# Altium schematic sheet KS-WL-GW-POWER.SchDoc
size A4; CheckedBy: Fan mingjie; DrawnBy: Jason Huang; Address1: Buliding 5, No.1528; Address2: Gu Mei Rd HQ6; Address3: Shanghai, China; Address4: 20233; DocumentNumber: 1; Revision: 1; SheetNumber: 1; SheetTotal: 2
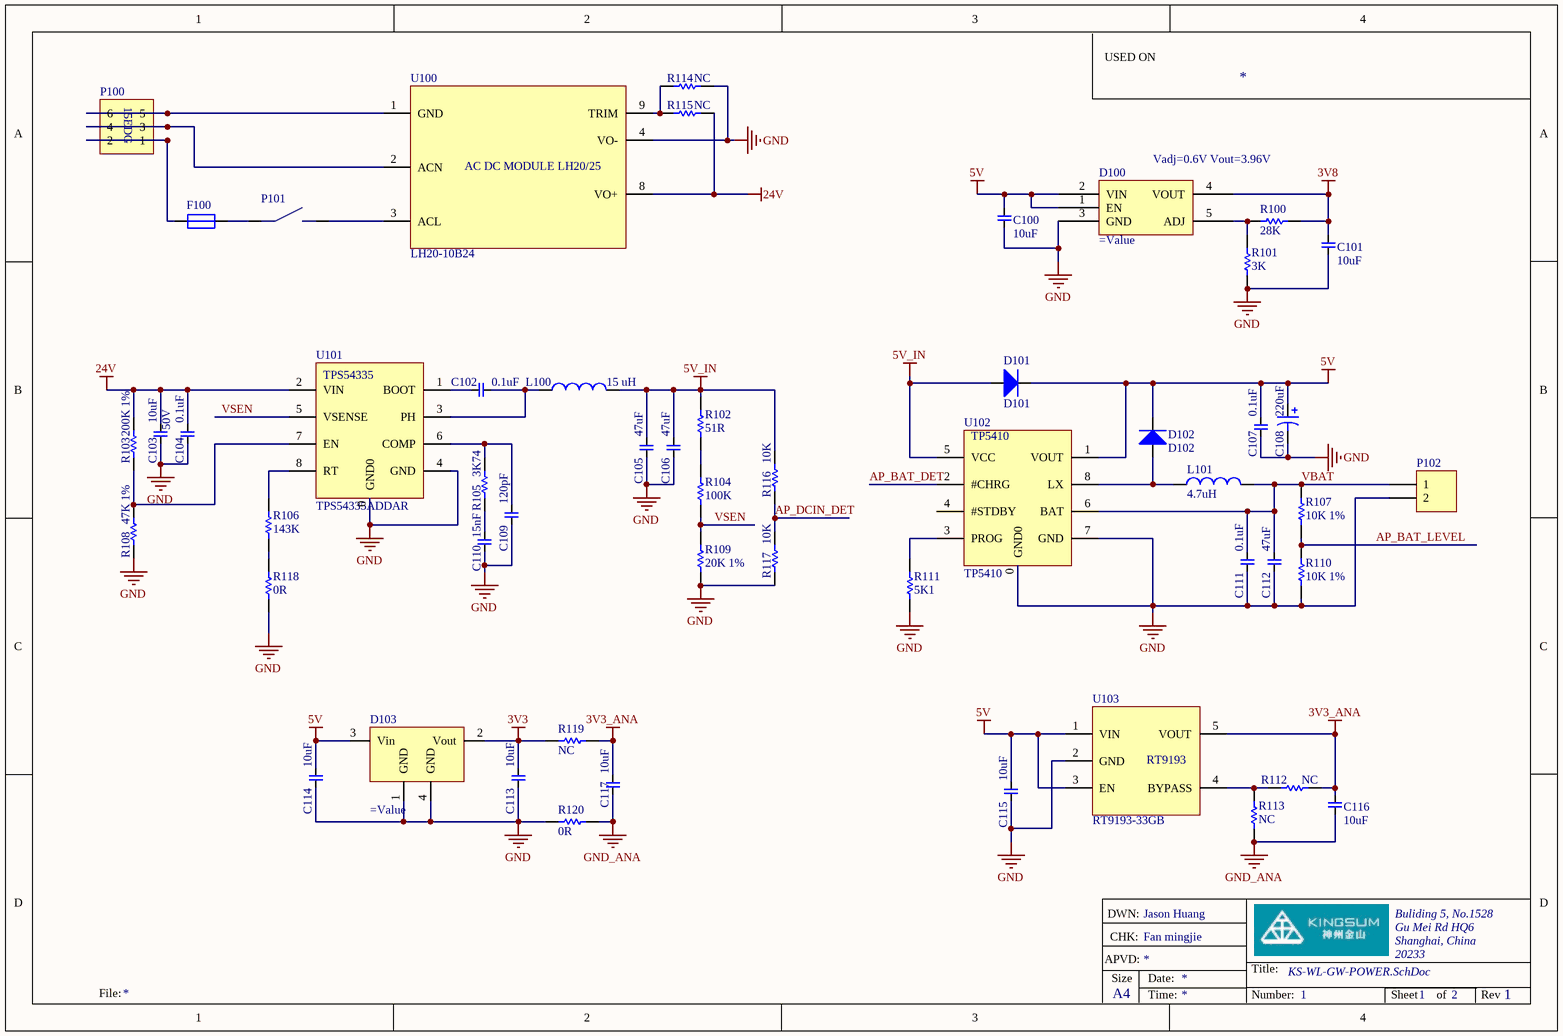
[diagram p0: KS-WL-GW-POWER.SchDoc]

## Parts
C100  10uF  [C1206_L]
C101  10uF  [C1206_L]
C102  0.1uF  [0402 CAP]
C103  10uF  Volt-Rated: 50V  [C1206_L]
C104  0.1uF  [0402 CAP]
C105  47uF  [C1206]
C106  47uF  [C1206]
C107  0.1uF  [0402 CAP]
C108  220uF  [LC-CASE-B_3528]
C109  120pF  [0402 CAP]
C110  15nF  [0402 CAP]
C111  0.1uF  [0402 CAP]
C112  47uF  [C1206]
C113  10uF  [C1206_L]
C114  10uF  [C1206_L]
C115  10uF  [C1206_L]
C116  10uF  [C1206_L]
C117  10uF  [C1206_L]
D100  (no value)  [LC-TO-263-5]
D101  D101  [LC-SMB(DO-214AA)_S5]
D102  D102  [LC-SMB(DO-214AA)_S5]
D103  (no value)  [SOT223_M]
F100  FUSE-SOCKET 20X5.2  [FUSE Socket]  (value not drawn)
L100  15 uH  [IND 100x100]
L101  4.7uH  [IND 50X40]
P100  Kingsum-CONN-15EDG 3X2  [15EDG-3x2 lock]  (value not drawn)
P101  Kingsum-SWITCH-AC-Panel  [XW-601AB1]  (value not drawn)
P102  Kingsum-CONN-XH-2AWD  [XH-2AWD]  (value not drawn)
R100  28K  [0402 Res]
R101  3K  [0402 Res]
R102  51R  [0402 Res]
R103  200K 1%  [0402 Res]
R104  100K  [0402 Res]
R105  3K74  [0603 RES]
R106  143K  [0402 Res]
R107  10K 1%  [0402 Res]
R108  47K 1%  [0402 Res]
R109  20K 1%  [0402 Res]
R110  10K 1%  [0402 Res]
R111  5K1  [0402 Res]
R112  NC  [0402 Res]
R113  NC  [0402 Res]
R114  NC  [0402 Res]
R115  NC  [0402 Res]
R116  10K  [0402 Res]
R117  10K  [0402 Res]
R118  0R  [0402 Res]
R119  NC  [0402 Res]
R120  0R  [0402 Res]
U100  LH20-10B24  [LH25]
U101  TPS54335ADDAR  [SOIC-SN8_EP]
U102  TP5410  [SOIC-SN8_EP]
U103  RT9193-33GB  [SOT23-05]

## Nets
3V3: C113.2 D103.2(Vout) R119.1
3V3_ANA: C116.2 C117.2 R112.1 R119.2 U103.5(VOUT)
3V8: C101.2 D100.4(VOUT) R100.1
5V: C100.2 C107.2 C108.1 C114.2 C115.2 D100.1(EN) D100.2(VIN) D101.2 D102.2 D103.3(Vin) U102.1(VOUT) U103.1(VIN) U103.3(EN)
5V_IN: C105.2 C106.2 D101.1 L100.2 R102.2 R116.2 U102.5(VCC)
24V: C103.2 C104.2 R103.2 R115.2 U100.8(VO+) U101.2(VIN)
GND: C100.1 C101.1 C103.1 C104.1 C105.1 C106.1 C107.1 C108.2 C109.1 C110.2 C111.1 C112.1 C113.1 C114.1 C115.1 D100.3(GND) D103.1(GND) D103.4(GND) P102.2 R101.1 R108.1 R109.1 R110.1 R111.1 R114.2 R117.1 R118.1 R120.1 U100.4(VO-) U101.0(GND0) U101.4(GND) U102.0(GND0) U102.7(GND) U103.2(GND)
GND_ANA: C116.1 C117.1 R113.1 R120.2
AP_BAT_DET: U102.2(#CHRG)
AP_BAT_LEVEL: R107.1 R110.2
AP_DCIN_DET: R116.1 R117.2
VBAT: C111.2 C112.2 L101.2 P102.1 R107.2 U102.6(BAT)
VSEN: R104.1 R109.2 U101.5(VSENSE)
NetC102_1: C102.1 L100.1 U101.3(PH)
NetC102_2: C102.2 U101.1(BOOT)
NetC109_2: C109.2 R105.2 U101.6(COMP)
NetC110_1: C110.1 R105.1
NetD100_5: D100.5(ADJ) R100.2 R101.2
NetD102_1: D102.1 L101.1 U102.8(LX)
NetF100_1: F100.1 P100.1 P100.2
NetF100_2: F100.2 P101.1
NetP100_3: P100.3 P100.4 U100.2(ACN)
NetP100_5: P100.5 P100.6 U100.1(GND)
NetP101_2: P101.2 U100.3(ACL)
NetR102_1: R102.1 R104.2
NetR103_1: R103.1 R108.2 U101.7(EN)
NetR106_1: R106.1 R118.2
NetR106_2: R106.2 U101.8(RT)
NetR111_2: R111.2 U102.3(PROG)
NetR112_2: R112.2 R113.2 U103.4(BYPASS)
NetR114_1: R114.1 R115.1 U100.9(TRIM)

Not connected (* = marked no-connect by the designer): U102 4(#STDBY)

## Notes on the sheet
- USED ON
- (near D100) Vadj=0.6V Vout=3.96V
- DWN:
- APVD:
- CHK:
- Size
- Date:
- Title:
- File:
- A4
- Time:
- Number:
- Sheet
- of
- Rev
- (in symbol Kingsum-ACDC-LH20-10B24) AC DC MODULE LH20/25
- (in symbol Kingsum-CONN-15EDG 3X2) 15EDG
- (in symbol Kingsum-DCDC-TPS54335ADDAR) TPS54335
- (in symbol Kingsum-LDO-RT9193-33GB) RT9193

## Library data of the parts
C100 C101 C113-C117 = ADE-C1206-10U: Non-polarised capacitor; Part Rev: V; Part Description: CAPACITOR, CERAMIC CHIP, 1206 CASE, SURFACE MOUNT , 10uF +/-20% 25V, X5R; Mfr_PN: GRM31CR61E106KE15; Manufacturer: MURATA; Tolerance: +/-20%; Volt-Rated: 25V; Signal Integrity: Cap; Option: 0; TE PN: ADE-C1206-10U; Series: MLCC; RoHS Compliant: YES; Value: 10uF; Package: C1206_L; Footprint: C1206; SPICE model: CAP; Published: 10/17/2016; Publisher: TE Connectivity; LatestRevisionDate: 08/05/2013; LatestRevisionNote: Production; ComponentLink1Description: Datasheet; ComponentLink1URL: http://www.murata.com/products/catalog/pdf/c02e.pdf; ComponentLink3Description: Package; ComponentLink2Description: Web Page
C102 C104 C107 C111 = ADE-C0402-0.1U: Non-polarised capacitor; Part Rev: V; Part Description: CAPACITOR, CERAMIC CHIP, 0402 CASE, SURFACE MOUNT , 0.1 uF +/-20% 25 V, X7R; Mfr_PN: GRM155R61E104KA87; Manufacturer: MURATA; Tolerance: +/-10%; Volt-Rated: 25 V; Signal Integrity: Cap; Option: 0; TE PN: ADE-C0402-0.1U; Series: MLCC; RoHS Compliant: YES; Value: 0.1uF; Package: 0402; Footprint: 0402; SPICE model: CAP; Published: 10/14/2016; Publisher: TE Connectivity; LatestRevisionDate: 04/22/2013; LatestRevisionNote: Production; ComponentLink1Description: Datasheet; ComponentLink1URL: http://engineeringportal.tycoelectronics.com/web/engineering/part-inquiry?PartNo=1-20065-7; ComponentLink3Description: Package; ComponentLink3URL: http://www.murata.com/products/catalog/pdf/c02e.pdf; ComponentLink2Description: Web Page; ComponentLink2URL: http://dmtec.tycoelectronics.com/dmtec/servlet/DocumentLookup?type=Production+Drawing&name=20065&format=PDF; Manufacturer2: Yageo; Mfr_PN2: CC0402KRX7R8BB104
C103 = Kingsum-C1206-10U 50V: Non-polarised capacitor; Part Rev: V; Part Description: CAPACITOR, CERAMIC CHIP, 1206 CASE, SURFACE MOUNT , 10uF +/-20% 25V, X5R; Mfr_PN: GRM31CR61H106KA12L; Manufacturer: MURATA; Tolerance: +/-20%; Signal Integrity: Cap; Option: 0; Series: MLCC; RoHS Compliant: YES; Value: 10uF; Package: C1206_L; Footprint: C1206; SPICE model: CAP; Published: 10/17/2016; Publisher: TE Connectivity; LatestRevisionDate: 08/05/2013; LatestRevisionNote: Production; ComponentLink1Description: Procurement; ComponentLink1URL: http://www.szlcsc.com/product/details_78219.html; ComponentLink3Description: Package; ComponentLink2Description: Web Page; Price: 0.258; Kingsum PN: Kingsum-C1206-10U 50V
C105 C106 C112 = ADE-C1206-47U: Non-polarised capacitor; Part Rev: V; Part Description: CAPACITOR, CERAMIC CHIP, 1206 CASE, SURFACE MOUNT , 47 uF +/-20% 10 V, X5R; Mfr_PN: GRM31CR61A476ME15; Manufacturer: MURATA; Tolerance: +/-20%; Volt-Rated: 10 V; Signal Integrity: Cap; Option: 0; TE PN: ADE-C1206-47U; Series: MLCC; RoHS Compliant: YES; Value: 47uF; Package: C1206; SPICE model: CAP; Published: 10/17/2016; Publisher: TE Connectivity; LatestRevisionDate: 08/05/2013; LatestRevisionNote: Production; ComponentLink1Description: Datasheet; ComponentLink1URL: http://engineeringportal.tycoelectronics.com/web/engineering/part-inquiry?PartNo=1-20065-7; ComponentLink3Description: Package; ComponentLink3URL: http://www.murata.com/products/catalog/pdf/c02e.pdf; ComponentLink2Description: Web Page; ComponentLink2URL: http://dmtec.tycoelectronics.com/dmtec/servlet/DocumentLookup?type=Production+Drawing&name=20065&format=PDF
C108 = Kingsum-Cap-Tan-220uF-6V3: CAP,  Tan, 100uF 6V3 10%  105c, 4-10Khr Life, Hi Ripple, Low Imped; Part Rev: V; Mfr_PN: TC212B227M006A; Manufacturer: Sunlord; TE PN: ADE-Cap-Electrolytic-25V-220uF; Tolerance: +-20%; Option: 0; Series: Electrolytic; Part Description: CAP,  Tan, 100uF 6V3 10%  105c, 4-10Khr Life, Hi Ripple, Low Imped; RoHS Compliant: YES; Value: 220uF; Package: 3528; Volt-Rated: 6V3; Footprint: 3528; SPICE model: CAP; Signal Integrity: Cap; Published: 10/17/2016; Publisher: TE Connectivity; LatestRevisionNote: Production; ComponentLink1Description: Datasheet; ComponentLink1URL: http://www.rubycon.co.jp/cn/catalog/capacitors.html; ComponentLink3Description: Procurement; ComponentLink3URL: http://www.szlcsc.com/product/details_112141.html; ComponentLink2Description: Web Page
C109 = ADE-C0402-120P: Non-polarised capacitor; Part Rev: V; Part Description: CAPACITOR, CERAMIC CHIP, 0402 CASE, SURFACE MOUNT , 120 pF +/-5% 50 V, C0G; Mfr_PN: GRM1555C1H121JA01; Manufacturer: MURATA; Tolerance: +/-5%; Volt-Rated: 50 V; Signal Integrity: Cap; Option: 0; TE PN: ADE-C0402-120P; Series: MLCC; RoHS Compliant: YES; Value: 120pF; Package: 0402; Footprint: 0402; SPICE model: CAP; Published: 10/17/2016; Publisher: TE Connectivity; LatestRevisionDate: 04/22/2013; LatestRevisionNote: Production; ComponentLink1Description: Datasheet; ComponentLink1URL: http://engineeringportal.tycoelectronics.com/web/engineering/part-inquiry?PartNo=1-20065-7; ComponentLink3Description: Package; ComponentLink3URL: http://www.murata.com/products/catalog/pdf/c02e.pdf; ComponentLink2Description: Web Page; ComponentLink2URL: http://dmtec.tycoelectronics.com/dmtec/servlet/DocumentLookup?type=Production+Drawing&name=20065&format=PDF; Price: *; Stock: *; Stock Position: *
C110 = ADE-C0402-15n: Non-polarised capacitor; Part Rev: V; Part Description: CAPACITOR, CERAMIC CHIP, 0402 CASE, SURFACE MOUNT , 15 nF +/-5% 50 V, C0G; Mfr_PN: GRM1555C1H153JA01; Manufacturer: MURATA; Tolerance: +/-5%; Volt-Rated: 50 V; Signal Integrity: Cap; Option: 0; TE PN: ADE-C0402-15n; Series: MLCC; RoHS Compliant: YES; Value: 15nF; Package: 0402; Footprint: 0402; SPICE model: CAP; Published: 10/14/2016; Publisher: TE Connectivity; LatestRevisionDate: 04/22/2013; LatestRevisionNote: Production; ComponentLink1Description: Datasheet; ComponentLink1URL: http://engineeringportal.tycoelectronics.com/web/engineering/part-inquiry?PartNo=1-20065-7; ComponentLink3Description: Package; ComponentLink3URL: http://www.murata.com/products/catalog/pdf/c02e.pdf; ComponentLink2Description: Web Page; ComponentLink2URL: http://dmtec.tycoelectronics.com/dmtec/servlet/DocumentLookup?type=Production+Drawing&name=20065&format=PDF; Price: *; Stock: *; Stock Position: *
D100 = Kingsum-LDO-LP38501ATJ: LDO 3.8V Output 3A; Part Rev: V; Manufacturer: TI; Volt-Rated: 6.5 V; Option: 0; Kingsum PN: Kingsum-LDO-LP38501ATJ; Part Description: LDO 3.8V Output 3A; RoHS Compliant: YES; Package: TO-263; Footprint: TO-263; SPICE model: LDO; Signal Integrity: LDO; Published: 09/04/2014; Publisher: TE Connectivity; LatestRevisionDate: 04/11/2013; LatestRevisionNote: Production; ComponentLink1Description: Datasheet; ComponentLink1URL: http://pdf1.alldatasheet.com/datasheet-pdf/view/352147/ONSEMI/CAT6219.html; Mfr_PN: LP38501ATJ; ComponentLink3Description: Package; ComponentLink3URL: http://www.alldatasheet.com/view.jsp?Searchword=Cat6219; ComponentLink2Description: Web Page; ComponentLink2URL: http://www.alldatasheet.com/view.jsp?Searchword=Cat6219
D101 D102 = Kingsum-DIODE-SS310: DIODE, Schottky, 100V, 3A, 0.74V; Part Rev: A; Mfr_PN: SS310; Manufacturer: DIODES; Volt-Rated: 150 V; Option: 0; ComponentLink2Description: Web Page; ComponentLink2URL: http://www.diodes.com/?q=downloads/7498; Series: Diode; Part Description: DIODE, Schottky, 100V, 3A, 0.74V; ComponentLink3URL: http://www.szlcsc.com/product/details_14941.html; RoHS Compliant: YES; Value: 3A; Package: SMB; Footprint: SMB; SPICE model: Diode; Published: 2015/06/23; Publisher: TE Connectivity; LatestRevisionNote: Production; ComponentLink1URL: http://www.diodes.com/?q=downloads/7498; ComponentLink1Description: Datasheet; ComponentLink3Description: Procurement; Price: 0.226; Kingsum PN: Kingsum-DIODE-SS310
D103 = Kingsum-LDO-TLV1117-33CDCYR: LDO 3.3V， 800mA Output; Part Rev: V; Part Description: LDO, SOT-223, 3.3V, 800mA; Manufacturer: TI; Volt-Rated: 15 V; Option: 0; Kingsum PN: Kingsum-LDO-TLV1117-33CDCYR; RoHS Compliant: YES; Package: SOT-223; Footprint: SOT-223; SPICE model: LDO; Signal Integrity: LDO; Published: 05/02/2015; Publisher: TE Connectivity; LatestRevisionDate: 04/11/2013; LatestRevisionNote: Production; ComponentLink1Description: Datasheet; ComponentLink1URL: http://www.st.com/web/en/resource/technical/document/datasheet/CD00000544.pdf; Mfr_PN: TLV1117-33CDCYR; ComponentLink3Description: Package; ComponentLink3URL: http://www.st.com/web/en/resource/technical/document/datasheet/CD00000544.pdf; ComponentLink2Description: Web Page; ComponentLink2URL: http://www.st.com/web/en/resource/technical/document/datasheet/CD00000544.pdf
F100 = Kingsum-FUSE-SOCKET 20X5.2: Fuse, Socket, 20X5.2, 6A, 250Vac; Part Rev: A; Manufacturer: Belfuse; Option: 0; Kingsum PN: Kingsum-FUSE-SOCKET 20X5.2; ComponentLink2Description: Web Page; Series: FUSE; Part Description: Fuse, Socket, 20X5.2, 6A, 250Vac; Mfr_PN: FUSE-SOCKET 20X5.2; RoHS Compliant: YES; Value: 6A; Volt-Rated: 250Vac; Published: 18/03/2014; Publisher: TE Connectivity; LatestRevisionDate: 11/15/2012; LatestRevisionNote: Production; ComponentLink1URL: http://belfuse.com/pdfs/RST.pdf; ComponentLink1Description: Datasheet; ComponentLink3Description: Package
L100 = Kingsum-Inductor-L100_100 15uH 2A2: INDUCTOR, Power, 2200mA, CHIP, WIREWOUND, SURFACE MOUNT , 15 UH +/-20%; Part Rev: J; Mfr_PN: SLF10145T-150M2R2-PF; Manufacturer: TDK; DC Resistance (DCR): 0.57 OHMs; Shielding: NO; Frequency - Self Resonant: 20MHz; Current Rating: 520 mA R; Option: 0; Series: Inductor; Part Description: INDUCTOR, Power, 2200mA, CHIP, WIREWOUND, SURFACE MOUNT , 15 UH +/-20%; RoHS Compliant: NO; Value: 15 uH; Precision: +/-20%; Package: 3225Ind; Footprint: 0402CS; SPICE model: INDUCTOR; Signal Integrity: Inductor; Published: 1/1/2013; Publisher: TE Connectivity; LatestRevisionDate: 1/11/2012; LatestRevisionNote: PRODUCTION; ComponentLink1Description: Datasheet; ComponentLink2Description: Web Page; ComponentLink3Description: Procurement; ComponentLink3URL: http://www.szlcsc.com/product/details_77974.html; Price: 1.19; Kingsum PN: Kingsum-Inductor-L100_100 15uH 2A2
L101 = Kingsum-Inductor-L50_40 4.7uH 3A5: INDUCTOR, Power, 3500mA, CHIP, WIREWOUND, SURFACE MOUNT , 2.2 UH +/-20%; Part Rev: J; Mfr_PN: SWPA5040S4R7MT; Manufacturer: TDK; DC Resistance (DCR): 0.025 OHMs; Shielding: NO; Frequency - Self Resonant: 20MHz; Current Rating: 3500mA R; Option: 0; Series: Inductor; Part Description: INDUCTOR, Power, 3500mA, CHIP, WIREWOUND, SURFACE MOUNT , 2.2 UH +/-20%; RoHS Compliant: NO; Value: 4.7uH; Precision: +/-20%; Package: IND5040; Footprint: IND5040; SPICE model: INDUCTOR; Signal Integrity: Inductor; Published: 1/1/2013; Publisher: TE Connectivity; LatestRevisionDate: 1/11/2012; LatestRevisionNote: PRODUCTION; ComponentLink1Description: Datasheet; ComponentLink2Description: Web Page; ComponentLink3Description: Procurement; ComponentLink3URL: http://www.szlcsc.com/product/details_49503.html; Price: 0.34; Kingsum PN: Kingsum-Inductor-L50_40 4.7uH 3A5
P100 = Kingsum-CONN-15EDG 3X2: Header, 6pin, 3x2; Manufacturer: 奥斯电子有限公司; Mfr_PN: 15EDGKDM-3.81-3P Set; Part Description: Header 15EDG Right angle 3.81mm 2X3P; Option: 0; Publisher: Belle 13600268167; ComponentLink2Description: Web Page; ComponentLink1Description: Datasheet; ComponentLink3Description: Package; Price: 6.48; ComponentLink3URL: https://item.taobao.com/item.htm?spm=a1z0d.6639537.1997196601.27.7be0196qmpE2w&id=530250136705
P101 = Kingsum-SWITCH-AC-Panel: XW-601AB1; Option: 0; LatestRevisionDate: 17-Jul-2002; LatestRevisionNote: Re-released for DXP Platform.; ComponentLink2Description: Web Page; ComponentLink1Description: Datasheet; ComponentLink3Description: Package; Mfr_PN: XW-601AB1; Published: 10/20/2016; Part Description: SWITCH-AC-Panel
P102 = Kingsum-CONN-XH-2AWD: Header 2.54mm 1*2P Right angle; Manufacturer: BOOM; Option: 0; LatestRevisionDate: 17-Jul-2002; LatestRevisionNote: Re-released for DXP Platform.; Publisher: TE Connectivity; ComponentLink2Description: Web Page; ComponentLink1Description: Datasheet; ComponentLink3Description: Procurement; ComponentLink3URL: http://www.szlcsc.com/product/details_28660.html; Mfr_PN: XH-2AWD; Kingsum PN: Kingsum-CONN-XH-2A; Published: 10/19/2016; Part Description: Header 2.54mm 1*2P Right angle
R100 = ADE-R0402-28K: RESISTOR  Normal; Part Rev: A; Part Description: RESISTOR, CHIP, THICK FILM, SURGE CURRENT, 0402 CASE, 1/16 W, 50 V , 28K OHMS +/-5%, +/-100 PPM/DEG C, TIN TERMINATION; Mfr_PN: RC0402JR-7D28KL; Manufacturer: YAGEO; Precision: +/-5%; Volt-Rated: 50 V; Power-Rated: 1/16 W; Signal Integrity: Res; Option: 0; TE_PN: ADE-R0402-28K; ComponentLink2Description: Web Page; ComponentLink2URL: http://dmtec.tycoelectronics.com/dmtec/servlet/DocumentLookup?type=Production+Drawing&name=1900457&format=PDF; Series: General Purpose Chip Resistors; ComponentLink3URL: http://www.yageo.com/documents/recent/PYu-RC0402_51_RoHS_L_6_r.pdf; RoHS Compliant: YES; Value: 28K; Package: 0402; Footprint: kOA1E-0402; SPICE model: RESISTOR; Published: 25/04/2013; Publisher: TE Connectivity; LatestRevisionDate: 25/04/2013; LatestRevisionNote: Production; ComponentLink1URL: http://engineeringportal.tycoelectronics.com/web/engineering/part-inquiry?PartNo=1900457-1; ComponentLink1Description: Datasheet; ComponentLink3Description: Package
R101 = ADE-R0402-3K-1%: RESISTOR  Normal; Part Rev: A; Part Description: RESISTOR, CHIP, THICK FILM, SURGE CURRENT, 0402 CASE, 1/16 W, 50 V , 3K OHMS +/-1%, +/-100 PPM/DEG C, TIN TERMINATION; Mfr_PN: RC0402FR-073KL; Manufacturer: YAGEO; Precision: +/-1%; Volt-Rated: 50 V; Power-Rated: 1/16 W; Signal Integrity: Res; Option: 0; TE_PN: ADE-R0402-3K-1%; ComponentLink2Description: Web Page; ComponentLink2URL: http://dmtec.tycoelectronics.com/dmtec/servlet/DocumentLookup?type=Production+Drawing&name=1900457&format=PDF; Series: General Purpose Chip Resistors; ComponentLink3URL: http://www.yageo.com/documents/recent/PYu-RC0402_51_RoHS_L_6_r.pdf; RoHS Compliant: YES; Value: 3K; Package: 0402; Footprint: kOA1E-0402; SPICE model: RESISTOR; Published: 27/03/2014; Publisher: TE Connectivity; LatestRevisionDate: 25/04/2013; LatestRevisionNote: Production; ComponentLink1URL: http://engineeringportal.tycoelectronics.com/web/engineering/part-inquiry?PartNo=1900457-1; ComponentLink1Description: Datasheet; ComponentLink3Description: Package
R102 = ADE-R0402-51R: RESISTOR  Normal; Part Rev: A; Part Description: RESISTOR, CHIP, THICK FILM, SURGE CURRENT, 0402 CASE, 1/16 W, 50 V , 51 OHMS +/-5%, +/-100 PPM/DEG C, TIN TERMINATION; Mfr_PN: RC0402JR-7D51RL; Manufacturer: YAGEO; Precision: +/-5%; Volt-Rated: 50 V; Power-Rated: 1/16 W; Signal Integrity: Res; Option: 0; TE_PN: ADE-R0402-51R; ComponentLink2Description: Web Page; ComponentLink2URL: http://dmtec.tycoelectronics.com/dmtec/servlet/DocumentLookup?type=Production+Drawing&name=1900457&format=PDF; Series: General Purpose Chip Resistors; ComponentLink3URL: http://www.yageo.com/documents/recent/PYu-RC0402_51_RoHS_L_6_r.pdf; RoHS Compliant: YES; Value: 51R; Package: 0402; Footprint: kOA1E-0402; SPICE model: RESISTOR; Published: 25/04/2013; Publisher: TE Connectivity; LatestRevisionDate: 04/25/2013; LatestRevisionNote: Production; ComponentLink1URL: http://engineeringportal.tycoelectronics.com/web/engineering/part-inquiry?PartNo=1900457-1; ComponentLink1Description: Datasheet; ComponentLink3Description: Package
R103 = ADE-R0402-200K-1%: RESISTOR  Normal; Part Rev: A; Part Description: RESISTOR, CHIP, THICK FILM, SURGE CURRENT, 0402 CASE, 1/16 W, 50 V , 20K OHMS +/-5%, +/-100 PPM/DEG C, TIN TERMINATION; Mfr_PN: RC0402FR-7D200KL; Manufacturer: YAGEO; Precision: +/-1%; Volt-Rated: 50 V; Power-Rated: 1/16 W; Signal Integrity: Res; Option: 0; TE_PN: ADE-R0402-200K; ComponentLink2Description: Web Page; ComponentLink2URL: http://dmtec.tycoelectronics.com/dmtec/servlet/DocumentLookup?type=Production+Drawing&name=1900457&format=PDF; Series: General Purpose Chip Resistors; ComponentLink3URL: http://www.yageo.com/documents/recent/PYu-RC0402_51_RoHS_L_6_r.pdf; RoHS Compliant: YES; Value: 200K 1%; Package: 0402; Footprint: kOA1E-0402; SPICE model: RESISTOR; Published: 25/04/2013; Publisher: TE Connectivity; LatestRevisionDate: 25/04/2013; LatestRevisionNote: Production; ComponentLink1URL: http://engineeringportal.tycoelectronics.com/web/engineering/part-inquiry?PartNo=1900457-1; ComponentLink1Description: Datasheet; ComponentLink3Description: Package
R104 = ADE-R0402-100K-1%: RESISTOR  Normal; Part Rev: A; Part Description: RESISTOR, CHIP, THICK FILM, SURGE CURRENT, 0402 CASE, 1/16 W, 50 V , 100K OHMS +/-1%, +/-100 PPM/DEG C, TIN TERMINATION; Mfr_PN: RC0402FR-07100KL; Manufacturer: YAGEO; Precision: +/-1%; Volt-Rated: 50 V; Power-Rated: 1/16 W; Signal Integrity: Res; Option: 0; TE_PN: ADE-R0402-100K; ComponentLink2Description: Web Page; ComponentLink2URL: http://dmtec.tycoelectronics.com/dmtec/servlet/DocumentLookup?type=Production+Drawing&name=1900457&format=PDF; Series: General Purpose Chip Resistors; ComponentLink3URL: http://www.yageo.com/documents/recent/PYu-RC0402_51_RoHS_L_6_r.pdf; RoHS Compliant: YES; Value: 100K; Package: 0402; Footprint: 0402; SPICE model: RESISTOR; Published: 27/03/2014; Publisher: TE Connectivity; LatestRevisionDate: 25/04/2013; LatestRevisionNote: Production; ComponentLink1URL: http://engineeringportal.tycoelectronics.com/web/engineering/part-inquiry?PartNo=1900457-1; ComponentLink1Description: Datasheet; ComponentLink3Description: Package
R105 = ADE-R0603-3K74: RESISTOR  Normal; Part Rev: A; Part Description: RESISTOR, CHIP, THICK FILM, SURGE CURRENT, 0402 CASE, 1/16 W, 50 V , 3K74 OHMS +/-1%, +/-100 PPM/DEG C, TIN TERMINATION; Mfr_PN: RC0603FR-073K74L; Manufacturer: YAGEO; Precision: +/-1%; Volt-Rated: 50 V; Power-Rated: 1/16 W; Signal Integrity: Res; Option: 0; TE_PN: ADE-R0603-3K74; ComponentLink2Description: Web Page; ComponentLink2URL: http://dmtec.tycoelectronics.com/dmtec/servlet/DocumentLookup?type=Production+Drawing&name=1900457&format=PDF; Series: General Purpose Chip Resistors; ComponentLink3URL: http://www.yageo.com/documents/recent/PYu-RC0402_51_RoHS_L_6_r.pdf; RoHS Compliant: YES; Value: 3K74; Package: 0603; Footprint: 0402; SPICE model: RESISTOR; Published: 2014/08/25; Publisher: TE Connectivity; LatestRevisionDate: 11/15/2012; LatestRevisionNote: Production; ComponentLink1URL: http://engineeringportal.tycoelectronics.com/web/engineering/part-inquiry?PartNo=1900457-1; ComponentLink1Description: Datasheet; ComponentLink3Description: Package
R106 = ADE-R0402-169K: RESISTOR  Normal; Part Rev: A; Part Description: RESISTOR, CHIP, THICK FILM, SURGE CURRENT, 0402 CASE, 1/16 W, 50 V , 169K OHMS +/-5%, +/-100 PPM/DEG C, TIN TERMINATION; Mfr_PN: RC0402JR-7D169KL; Manufacturer: YAGEO; Value: 169K; Precision: +/-5%; Volt-Rated: 50 V; Power-Rated: 1/16 W; Signal Integrity: Res; Option: 0; TE_PN: ADE-R0402-169K; ComponentLink2Description: Web Page; ComponentLink2URL: http://dmtec.tycoelectronics.com/dmtec/servlet/DocumentLookup?type=Production+Drawing&name=1900457&format=PDF; Series: General Purpose Chip Resistors; ComponentLink3URL: http://www.yageo.com/documents/recent/PYu-RC0402_51_RoHS_L_6_r.pdf; RoHS Compliant: YES; Package: 0402; Footprint: kOA1E-0402; SPICE model: RESISTOR; Published: 27/03/2014; Publisher: TE Connectivity; LatestRevisionDate: 25/04/2013; LatestRevisionNote: Production; ComponentLink1URL: http://engineeringportal.tycoelectronics.com/web/engineering/part-inquiry?PartNo=1900457-1; ComponentLink1Description: Datasheet; ComponentLink3Description: Package
R107 R110 = ADE-R0402-10K-1%: RESISTOR  Normal; Part Rev: A; Part Description: RESISTOR, CHIP, THICK FILM, SURGE CURRENT, 0402 CASE, 1/16 W, 50 V , 10K OHMS +/-1%, +/-100 PPM/DEG C, TIN TERMINATION; Mfr_PN: RC0402FR-0710KL; Manufacturer: YAGEO; Precision: +/-1%; Volt-Rated: 50 V; Power-Rated: 1/16 W; Signal Integrity: Res; Option: 0; TE_PN: ADE-R0402-10K; ComponentLink2Description: Web Page; ComponentLink2URL: http://dmtec.tycoelectronics.com/dmtec/servlet/DocumentLookup?type=Production+Drawing&name=1900457&format=PDF; Series: General Purpose Chip Resistors; ComponentLink3URL: http://www.yageo.com/documents/recent/PYu-RC0402_51_RoHS_L_6_r.pdf; RoHS Compliant: YES; Value: 10K 1%; Package: 0402; Footprint: kOA1E-0402; SPICE model: RESISTOR; Published: 25/04/2013; Publisher: TE Connectivity; LatestRevisionDate: 25/04/2013; LatestRevisionNote: Production; ComponentLink1URL: http://engineeringportal.tycoelectronics.com/web/engineering/part-inquiry?PartNo=1900457-1; ComponentLink1Description: Datasheet; ComponentLink3Description: Package
R108 = ADE-R0402-47K-1%: RESISTOR  Normal; Part Rev: A; Part Description: RESISTOR, CHIP, THICK FILM, SURGE CURRENT, 0402 CASE, 1/16 W, 50 V , 20K OHMS +/-5%, +/-100 PPM/DEG C, TIN TERMINATION; Mfr_PN: RC0402FR-7D47KL; Manufacturer: YAGEO; TE_PN: ADE-R0402-20K; Precision: +/-1%; Volt-Rated: 50 V; Power-Rated: 1/16 W; Signal Integrity: Res; Option: 0; ComponentLink2Description: Web Page; ComponentLink2URL: http://dmtec.tycoelectronics.com/dmtec/servlet/DocumentLookup?type=Production+Drawing&name=1900457&format=PDF; Series: General Purpose Chip Resistors; ComponentLink3URL: http://www.yageo.com/documents/recent/PYu-RC0402_51_RoHS_L_6_r.pdf; RoHS Compliant: YES; Value: 47K 1%; Package: 0402; Footprint: kOA1E-0402; SPICE model: RESISTOR; Published: 25/04/2013; Publisher: TE Connectivity; LatestRevisionDate: 25/04/2013; LatestRevisionNote: Production; ComponentLink1URL: http://engineeringportal.tycoelectronics.com/web/engineering/part-inquiry?PartNo=1900457-1; ComponentLink1Description: Datasheet; ComponentLink3Description: Package
R109 = ADE-R0402-20K-1%: RESISTOR  Normal; Part Rev: A; Part Description: RESISTOR, CHIP, THICK FILM, SURGE CURRENT, 0402 CASE, 1/16 W, 50 V , 20K OHMS +/-5%, +/-100 PPM/DEG C, TIN TERMINATION; Mfr_PN: RC0402FR-7D20KL; Manufacturer: YAGEO; Precision: +/-1%; Volt-Rated: 50 V; Power-Rated: 1/16 W; Signal Integrity: Res; Option: 0; TE_PN: ADE-R0402-20K; ComponentLink2Description: Web Page; ComponentLink2URL: http://dmtec.tycoelectronics.com/dmtec/servlet/DocumentLookup?type=Production+Drawing&name=1900457&format=PDF; Series: General Purpose Chip Resistors; ComponentLink3URL: http://www.yageo.com/documents/recent/PYu-RC0402_51_RoHS_L_6_r.pdf; RoHS Compliant: YES; Value: 20K 1%; Package: 0402; Footprint: kOA1E-0402; SPICE model: RESISTOR; Published: 25/04/2013; Publisher: TE Connectivity; LatestRevisionDate: 25/04/2013; LatestRevisionNote: Production; ComponentLink1URL: http://engineeringportal.tycoelectronics.com/web/engineering/part-inquiry?PartNo=1900457-1; ComponentLink1Description: Datasheet; ComponentLink3Description: Package
R111 = ADE-R0402-5K1: RESISTOR  Normal; Part Rev: A; Part Description: RESISTOR, CHIP, THICK FILM, SURGE CURRENT, 0402 CASE, 1/16 W, 50 V , 5K1 OHMS +/-10%, +/-100 PPM/DEG C, TIN TERMINATION; Mfr_PN: RC0402JR-7D5K1L; Manufacturer: YAGEO; Precision: +/-5%; Volt-Rated: 50 V; Power-Rated: 1/16 W; Signal Integrity: Res; Option: 0; TE_PN: ADE-R0402-5K1; ComponentLink2Description: Web Page; ComponentLink2URL: http://dmtec.tycoelectronics.com/dmtec/servlet/DocumentLookup?type=Production+Drawing&name=1900457&format=PDF; Series: General Purpose Chip Resistors; ComponentLink3URL: http://www.yageo.com/documents/recent/PYu-RC0402_51_RoHS_L_6_r.pdf; RoHS Compliant: YES; Value: 5K1; Package: 0402; Footprint: kOA1E-0402; SPICE model: RESISTOR; Published: 25/04/2013; Publisher: TE Connectivity; LatestRevisionDate: 25/04/2013; LatestRevisionNote: Production; ComponentLink1URL: http://engineeringportal.tycoelectronics.com/web/engineering/part-inquiry?PartNo=1900457-1; ComponentLink1Description: Datasheet; ComponentLink3Description: Package
R112-R115 R119 = ADE-R0402-NC: RESISTOR  Normal; Part Rev: A; Part Description: RESISTOR, CHIP, THICK FILM, NC; Manufacturer: YAGEO; Precision: +/-5%; Power-Rated: 1/16 W; Signal Integrity: Res; Option: 0; TE_PN: -; ComponentLink2Description: Web Page; ComponentLink2URL: http://dmtec.tycoelectronics.com/dmtec/servlet/DocumentLookup?type=Production+Drawing&name=1900457&format=PDF; Series: General Purpose Chip Resistors; Mfr_PN: NC; ComponentLink3URL: http://www.yageo.com/documents/recent/PYu-RC0402_51_RoHS_L_6_r.pdf; RoHS Compliant: YES; Value: NC; Package: 0402; Volt-Rated: -; Footprint: kOA1E-0402; SPICE model: RESISTOR; Published: 25/04/2013; Publisher: TE Connectivity; LatestRevisionDate: 11/15/2012; LatestRevisionNote: Production; ComponentLink1URL: http://engineeringportal.tycoelectronics.com/web/engineering/part-inquiry?PartNo=1900457-1; ComponentLink1Description: Datasheet; ComponentLink3Description: Package
  R114 R115 R119: Designator: NC
R116 R117 = ADE-R0402-10K: RESISTOR  Normal; Part Rev: A; Part Description: RESISTOR, CHIP, THICK FILM, SURGE CURRENT, 0402 CASE, 1/16 W, 50 V , 10K OHMS +/-5%, +/-100 PPM/DEG C, TIN TERMINATION; Mfr_PN: RC0402JR-7D10KL; Manufacturer: YAGEO; Precision: +/-5%; Volt-Rated: 50 V; Power-Rated: 1/16 W; Signal Integrity: Res; Option: 0; TE_PN: ADE-R0402-10K; ComponentLink2Description: Web Page; ComponentLink2URL: http://dmtec.tycoelectronics.com/dmtec/servlet/DocumentLookup?type=Production+Drawing&name=1900457&format=PDF; Series: General Purpose Chip Resistors; ComponentLink3URL: http://www.yageo.com/documents/recent/PYu-RC0402_51_RoHS_L_6_r.pdf; RoHS Compliant: YES; Value: 10K; Package: 0402; Footprint: kOA1E-0402; SPICE model: RESISTOR; Published: 25/04/2013; Publisher: TE Connectivity; LatestRevisionDate: 25/04/2013; LatestRevisionNote: Production; ComponentLink1URL: http://engineeringportal.tycoelectronics.com/web/engineering/part-inquiry?PartNo=1900457-1; ComponentLink1Description: Datasheet; ComponentLink3Description: Package
R118 R120 = ADE-R0402-0R: RESISTOR  Normal; Part Rev: A; Part Description: RESISTOR, CHIP, THICK FILM, SURGE CURRENT, 0402 CASE, 1/16 W, 50V, 1 A , 0 OHMS +/-5%, +/-200 PPM/DEG C, TIN TERMINATION; Mfr_PN: RC0402JR-7D0RL; Manufacturer: YAGEO; Precision: +/-5%; Volt-Rated: 50 V; Power-Rated: 1/16 W; Signal Integrity: Res; Option: 0; TE_PN: ADE-R0402-0R; ComponentLink2Description: Web Page; ComponentLink2URL: http://dmtec.tycoelectronics.com/dmtec/servlet/DocumentLookup?type=Production+Drawing&name=1900457&format=PDF; Series: General Purpose Chip Resistors; ComponentLink3URL: http://www.yageo.com/documents/recent/PYu-RC0402_51_RoHS_L_6_r.pdf; RoHS Compliant: YES; Value: 0R; Package: 0402; Footprint: kOA1E-0402; SPICE model: RESISTOR; Published: 25/04/2013; Publisher: TE Connectivity; LatestRevisionDate: 11/15/2012; LatestRevisionNote: Production; ComponentLink1URL: http://engineeringportal.tycoelectronics.com/web/engineering/part-inquiry?PartNo=1900457-1; ComponentLink1Description: Datasheet; ComponentLink3Description: Package
U100 = Kingsum-ACDC-LH20-10B24: 85-264V，20W，24V AC/DC; Manufacturer: MORNSUN; Option: 0; Tmp Range: -40 to 70; Publisher: FMJ; ComponentLink1Description: Datasheet; ComponentLink1URL: Datasheet/DCDC; ComponentLink2Description: Web Page; ComponentLink3Description: Procurement; ComponentLink3URL: https://item.taobao.com/item.htm?spm=a230r.1.14.8.ebb2eb253Xc1p&id=14360412886&ns=1&abbucket=3#detail; Code_IPC: *; Code_JEITA: *; Footprint: LH20; LatestRevisionNote: PRODUCTION; Mfr_PN: LH20-10B24; Package: LH20; Part Rev: *; Published: 10/14/2016; RoHS Compliant: YES; Kingsum PN: Kingsum-ACDC-LH20-10B24; Part Description: 85-264V，20W，24V AC/DC; Price: 65; Stock: *; Stock Position: *
U101 = Kingsum-DCDC-TPS54335ADDAR: 3A, 28V, 500kHz Synchronous Step-Down Converter; Manufacturer: TI; Option: 0; Publisher: FMJ; ComponentLink1Description: Datasheet; ComponentLink1URL: Datasheet/DCDC; ComponentLink2Description: Web Page; ComponentLink3Description: Package; Code_IPC: *; Code_JEITA: *; Footprint: SOP8-EP; LatestRevisionNote: PRODUCTION; Mfr_PN: TPS54335ADDAR; Package: SOP8-EP; Part Rev: *; Published: 10/14/2016; RoHS Compliant: YES; Kingsum PN: Kingsum-DCDC-TPS54335ADDAR; Part Description: 3A, 28V, 500kHz Synchronous Step-Down Converter; Price: 24; Stock: *; Stock Position: *
U102 = Kingsum-Charger-TP5410: 1A,LION,5V/1A BOOST; Manufacturer: NanJing Top Power ASIC; Option: 0; Tmp Range: -40 to 85; Publisher: FMJ; ComponentLink1Description: Datasheet; ComponentLink1URL: Datasheet/CHARGER; ComponentLink2Description: Web Page; ComponentLink3Description: Procurement; ComponentLink3URL: http://www.szlcsc.com/product/details_81071.html; Code_IPC: *; Code_JEITA: *; Footprint: SO8-EP; LatestRevisionNote: PRODUCTION; Mfr_PN: TP5410; Package: SO8-EP; Part Rev: *; Published: 10/14/2016; RoHS Compliant: YES; Kingsum PN: Kingsum-Charger-TP5410; Part Description: 1A,LION,5V/1A BOOST; Price: 1; Stock: *; Stock Position: *
U103 = Kingsum-LDO-RT9193-33GB: 300mA, Ultra-Low Noise, Ultra-Fast CMOS LDO Regulator; Manufacturer: RICHTEK; Option: 0; Tmp Range: -40 t0 85; Publisher: FMJ; ComponentLink1Description: Datasheet; ComponentLink1URL: Datasheet/LDO; ComponentLink2Description: Web Page; ComponentLink3Description: Procurement; ComponentLink3URL: http://www.szlcsc.com/product/details_16332.html; Code_IPC: *; Code_JEITA: *; Footprint: SOT23-5; LatestRevisionNote: PRODUCTION; Mfr_PN: RT9193-33GB; Package: SOT23-5; Part Rev: *; Published: 10/14/2016; RoHS Compliant: YES; Kingsum PN: Kingsum-LDO-RT9193-33GB; Part Description: 300mA, Ultra-Low Noise, Ultra-Fast CMOS LDO Regulator; Price: 0.5; Stock: *; Stock Position: *